# Altium schematic sheet Connectors_USB.SchDoc
size A; SheetNumber: 3; SheetTotal: 3
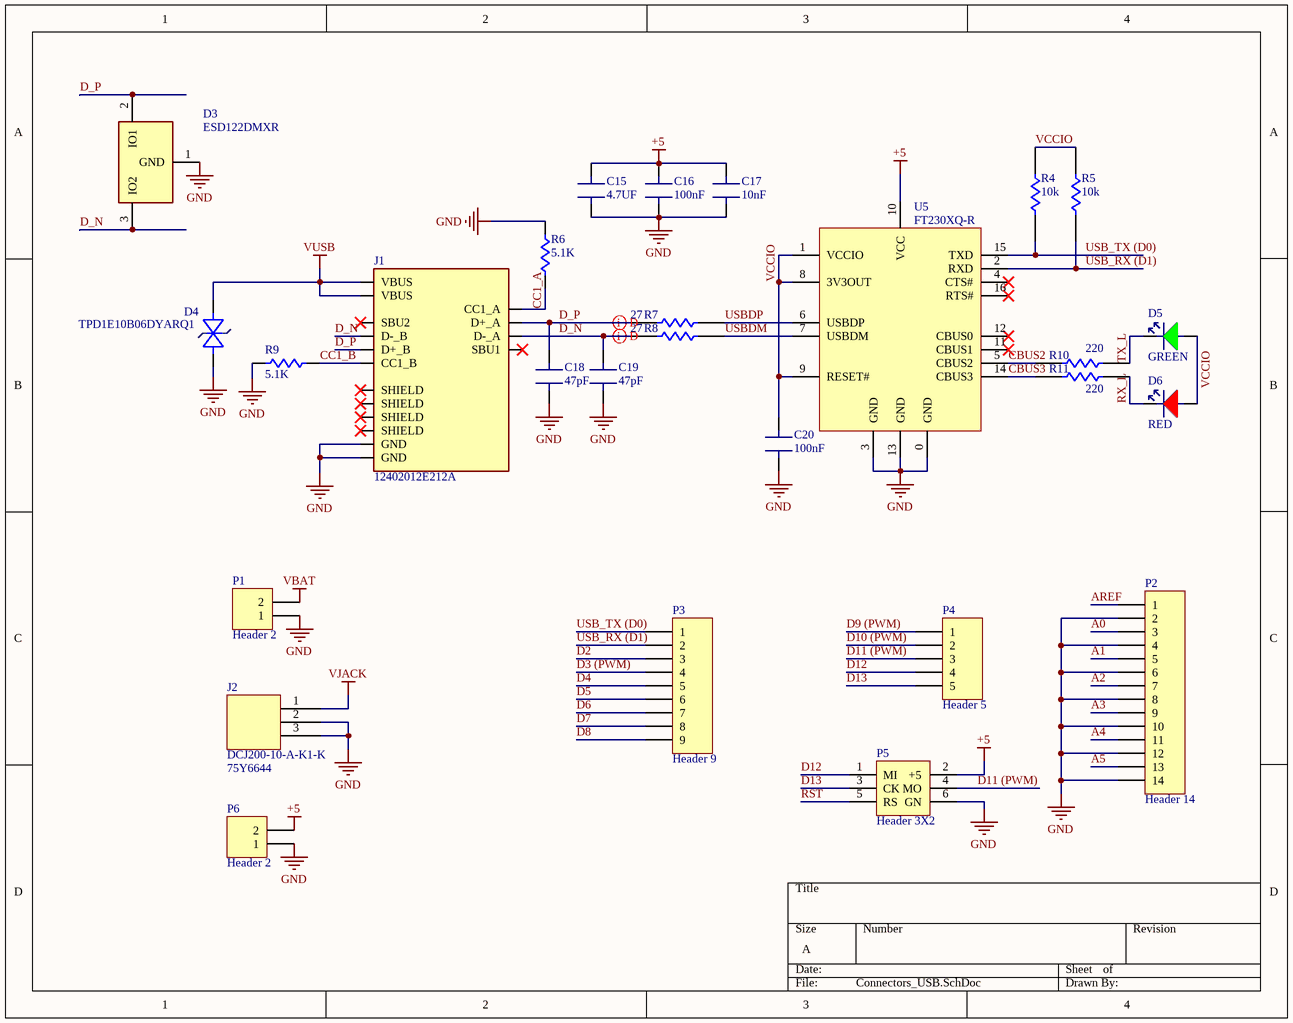
[diagram p0: Connectors_USB.SchDoc]

## Parts
C15  4.7UF  [CAPC1608X90N]
C16  100nF  [CAPC1608X90N]
C17  10nF  [CAPC1608X90N]
C18  47pF  [CAPC1608X90N]
C19  47pF  [CAPC1608X90N]
C20  100nF  [CAPC1608X90N]
D3  ESD122DMXR  [3-X2SON (1x0.6)]
D4  TPD1E10B06DYARQ1  [SOD-523]
D5  GREEN  [LED: 0805G]
D6  RED  [LED: 0805R]
J1  12402012E212A  [AMPHENOL_12402012E212A]
J2  DCJ200-10-A-K1-K  Supplier Part Number 1: 75Y6644  [DC JACK]
P1  Header 2  [HDR1X2]
P2  Header 14  [HDR1X14]
P3  Header 9  [HDR1X9]
P4  Header 5  [HDR1X5]
P5  Header 3X2  [HDR2X3]
P6  Header 2  [HDR1X2]
R4  10k  [RESC1608X55N]
R5  10k  [RESC1608X55N]
R6  5.1K  [RESC1608X55N]
R7  27  [RESC1608X55N]
R8  27  [RESC1608X55N]
R9  5.1K  [RESC1608X55N]
R10  220  [RESC1608X55N]
R11  220  [RESC1608X55N]
U5  FT230XQ-R  [16-QFN (4x4)]

## Nets
+5: C15.2(B) C16.2(B) C17.2(B) P5.2(+5) P6.2 U5.10(VCC)
GND: C15.1(A) C16.1(A) C17.1(A) C18.1(A) C19.1(A) C20.1(A) D3.1(GND) D4.2 J1.A1_B12(GND) J1.B1_A12(GND) J2.2 J2.3 P1.1 P2.2 P2.4 P2.6 P2.8 P2.10 P2.12 P2.14 P5.6(GN) P6.1 R6.2 R9.2 U5.0(GND) U5.3(GND) U5.13(GND)
VBAT: P1.2
VJACK: J2.1
VUSB: D4.1 J1.A4_B9(VBUS) J1.B4_A9(VBUS)
A0: P2.3
A1: P2.5
A2: P2.7
A3: P2.9
A4: P2.11
A5: P2.13
AREF: P2.1
CBUS2: R10.1 U5.5(CBUS2)
CBUS3: R11.1 U5.14(CBUS3)
CC1_A: J1.A5(CC1_A) R6.1
CC1_B: J1.B5(CC1_B) R9.1
D2: P3.3
D3 (PWM): P3.4
D4: P3.5
D5: P3.6
D6: P3.7
D7: P3.8
D8: P3.9
D9 (PWM): P4.1
D10 (PWM): P4.2
D11 (PWM): P4.3 P5.4(MO)
D12: P4.4 P5.1(MI)
D13: P4.5 P5.3(CK)
D_N: C19.2(B) D3.3(IO2) J1.A7(D-_A) J1.B7(D-_B) R8.1
D_P: C18.2(B) D3.2(IO1) J1.A6(D+_A) J1.B6(D+_B) R7.1
RST: P5.5(RS)
RX_L: D6.1(C) R11.2
TX_L: D5.1(C) R10.2
USB_RX (D1): P3.2 R5.1 U5.2(RXD)
USB_TX (D0): P3.1 R4.1 U5.15(TXD)
USBDM: R8.2 U5.7(USBDM)
USBDP: R7.2 U5.6(USBDP)
VCCIO: C20.2(B) D5.2(A) D6.2(A) R4.2 R5.2 U5.1(VCCIO) U5.8(3V3OUT) U5.9(RESET#)

Not connected (* = marked no-connect by the designer): J1 A8(SBU1)* B8(SBU2)* SH1(SHIELD)* SH2(SHIELD)* SH3(SHIELD)* SH4(SHIELD)*; U5 4(CTS#)* 11(CBUS1)* 12(CBUS0)* 16(RTS#)*

## Layout directives
differential pair: D_N, D_P

## Library data of the parts
C15 = 1276-1903-6-ND: CAP CER 4.7UF 25V X5R 0603; Supplier 1: Digi-Key; Supplier Part Number 1: 1276-1903-1-ND
C16 C20 = C14663: CAP CER 0.1UF 50V 10% X7R 0603
C17 = 1292-1386-6-ND: CAP CER 10000PF 50V X7R 0603; Supplier 1: Digi-Key; Supplier Part Number 1: 1292-1386-1-ND
C18 C19 = 311-3899-6-ND: CAP CER 47PF 50V C0G/NPO 0603; Supplier 1: Digi-Key; Supplier Part Number 1: 311-3899-1-ND
D3 = ESD122DMXR: TVS DIODE 3.6VWM 8.4VC 3X2SON; Supplier 1: Mouser; Supplier Part Number 1: 595-ESD122DMXR
D4 = TPD1E10B06DYARQ1: 14V (Typ) Clamp 6A (8/20µs) Ipp Tvs Diode Surface Mount SOT-5X3; Supplier 1: Mouser; Supplier Part Number 1: 595-TPD1E10B06DYARQ1
D5 = 732-4983-6-ND: LED GREEN CLEAR 0805 SMD; Supplier 1: Digi-Key; Supplier Part Number 1: 732-4983-1-ND
D6 = 732-4985-6-ND: LED RED CLEAR 0805 SMD; Supplier 1: Digi-Key; Supplier Part Number 1: 732-4985-1-ND
J1 = 12402012E212A: CONN RCP USB2.0 TYP C 24P SMD RA; Supplier 1: Mouser; Supplier Part Number 1: 523-12402012E212A
J2 = 2073-DCJ200-10-A-K1-K-ND: Power Barrel Connector Jack 2.05mm ID (0.081"), 5.50mm OD (0.217") Through Hole, Right Angle; Supplier 1: Newark
P1 P6 = Header 2: Header, 2-Pin; LatestRevisionDate: 17-Jul-2002; LatestRevisionNote: Re-released for DXP Platform.; Publisher: Altium Limited
P2 = Header 14: Header, 14-Pin; LatestRevisionDate: 17-Jul-2002; LatestRevisionNote: Re-released for DXP Platform.; Publisher: Altium Limited
P3 = Header 9: Header, 9-Pin; LatestRevisionDate: 17-Jul-2002; LatestRevisionNote: Re-released for DXP Platform.; Publisher: Altium Limited
P4 = Header 5: Header, 5-Pin; LatestRevisionDate: 17-Jul-2002; LatestRevisionNote: Re-released for DXP Platform.; Publisher: Altium Limited
P5 = Header 3X2: Header, 3-Pin, Dual row; LatestRevisionDate: 17-Jul-2002; LatestRevisionNote: Re-released for DXP Platform.; Publisher: Altium Limited
R4 R5 = RC0603FR-0710KL: RES SMD 10K OHM 1% 1/10W 0603; Supplier 1: Digi-Key; Supplier Part Number 1: 311-10.0KHRCT-ND
R6 R9 = 541-CRCW06035K10FKEBCDKR-ND: RES 5.1K OHM 1% 1/10W 0603; Supplier 1: Digi-Key; Supplier Part Number 1: 541-CRCW06035K10FKEBCCT-ND
R7 R8 = CR0603-FX-27R0ELFDKR-ND: RES SMD 27 OHM 1% 1/10W 0603; Supplier 1: Digi-Key; Supplier Part Number 1: CR0603-FX-27R0ELFCT-ND
R10 R11 = 311-220HRDKR-ND: RES SMD 220 OHM 1% 1/10W 0603; Supplier 1: Digi-Key; Supplier Part Number 1: 311-220HRCT-ND
U5 = FT230XQ-R: USB Bridge, USB to UART USB 2.0 UART Interface 16-QFN (4x4); Supplier 1: Mouser; Supplier Part Number 1: 895-FT230XQ-R